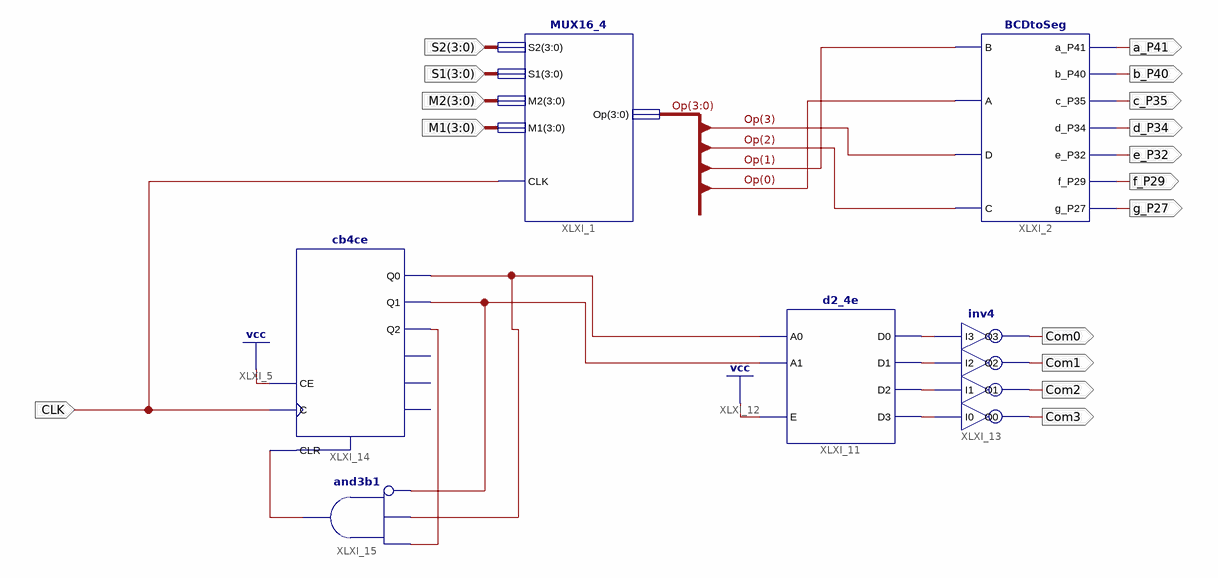
[diagram p0: schematic sheet 1]
// Xilinx ISE schematic Display.sch (spartan6) as structural Verilog: 6 symbols, 16 ports
module Display (
  input  CLK,
  input  [3:0] S2,
  input  [3:0] S1,
  input  [3:0] M2,
  input  [3:0] M1,
  output a_P41,
  output b_P40,
  output c_P35,
  output d_P34,
  output e_P32,
  output f_P29,
  output g_P27,
  output Com0,
  output Com1,
  output Com2,
  output Com3
);

  wire XLXN_40, XLXN_41, XLXN_42, XLXN_43, XLXN_116, XLXN_117, XLXN_118, XLXN_120;
  wire [3:0] Op;

  MUX16_4 XLXI_1 (.S2(S2), .S1(S1), .M2(M2), .M1(M1), .CLK(CLK), .Op(Op));
  BCDtoSeg XLXI_2 (
    .B(Op[1]), .A(Op[0]), .D(Op[3]), .C(Op[2]), .a_P41(a_P41), .b_P40(b_P40), .c_P35(c_P35), .d_P34(d_P34),
    .e_P32(e_P32), .f_P29(f_P29), .g_P27(g_P27));
  d2_4e XLXI_11 (.A0(XLXN_116), .A1(XLXN_117), .E(1'b1), .D0(XLXN_43), .D1(XLXN_42), .D2(XLXN_41), .D3(XLXN_40));
  inv4 XLXI_13 (.I0(XLXN_40), .I1(XLXN_41), .I2(XLXN_42), .I3(XLXN_43), .O0(Com3), .O1(Com2), .O2(Com1), .O3(Com0));
  cb4ce XLXI_14 (.C(CLK), .CE(1'b1), .CLR(XLXN_120), .Q0(XLXN_116), .Q1(XLXN_117), .Q2(XLXN_118));  // open: CEO, Q3, TC
  and XLXI_15 (XLXN_120, ~XLXN_117, XLXN_116, XLXN_118);  // and3b1
endmodule
